# Altium schematic sheet Keyboard_MAIN.SchDoc
size A4
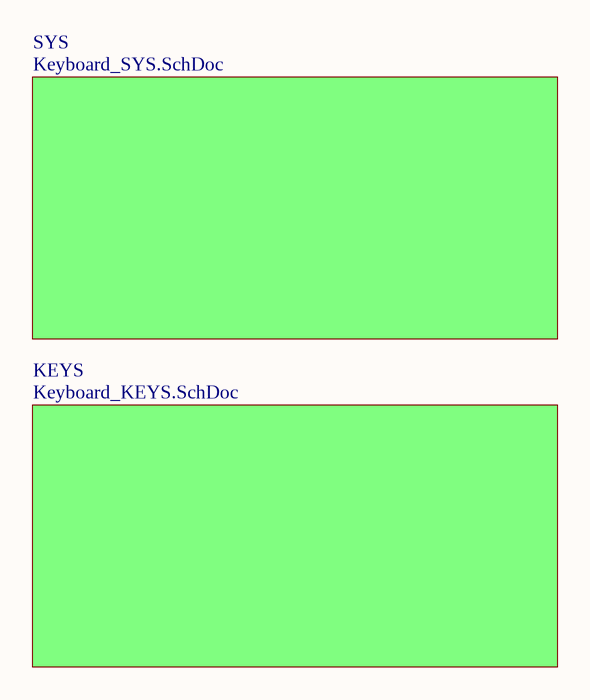
[diagram p0: Keyboard_MAIN.SchDoc]

## Sub-sheets
KEYS = Keyboard_KEYS.SchDoc: no entries
SYS = Keyboard_SYS.SchDoc: no entries